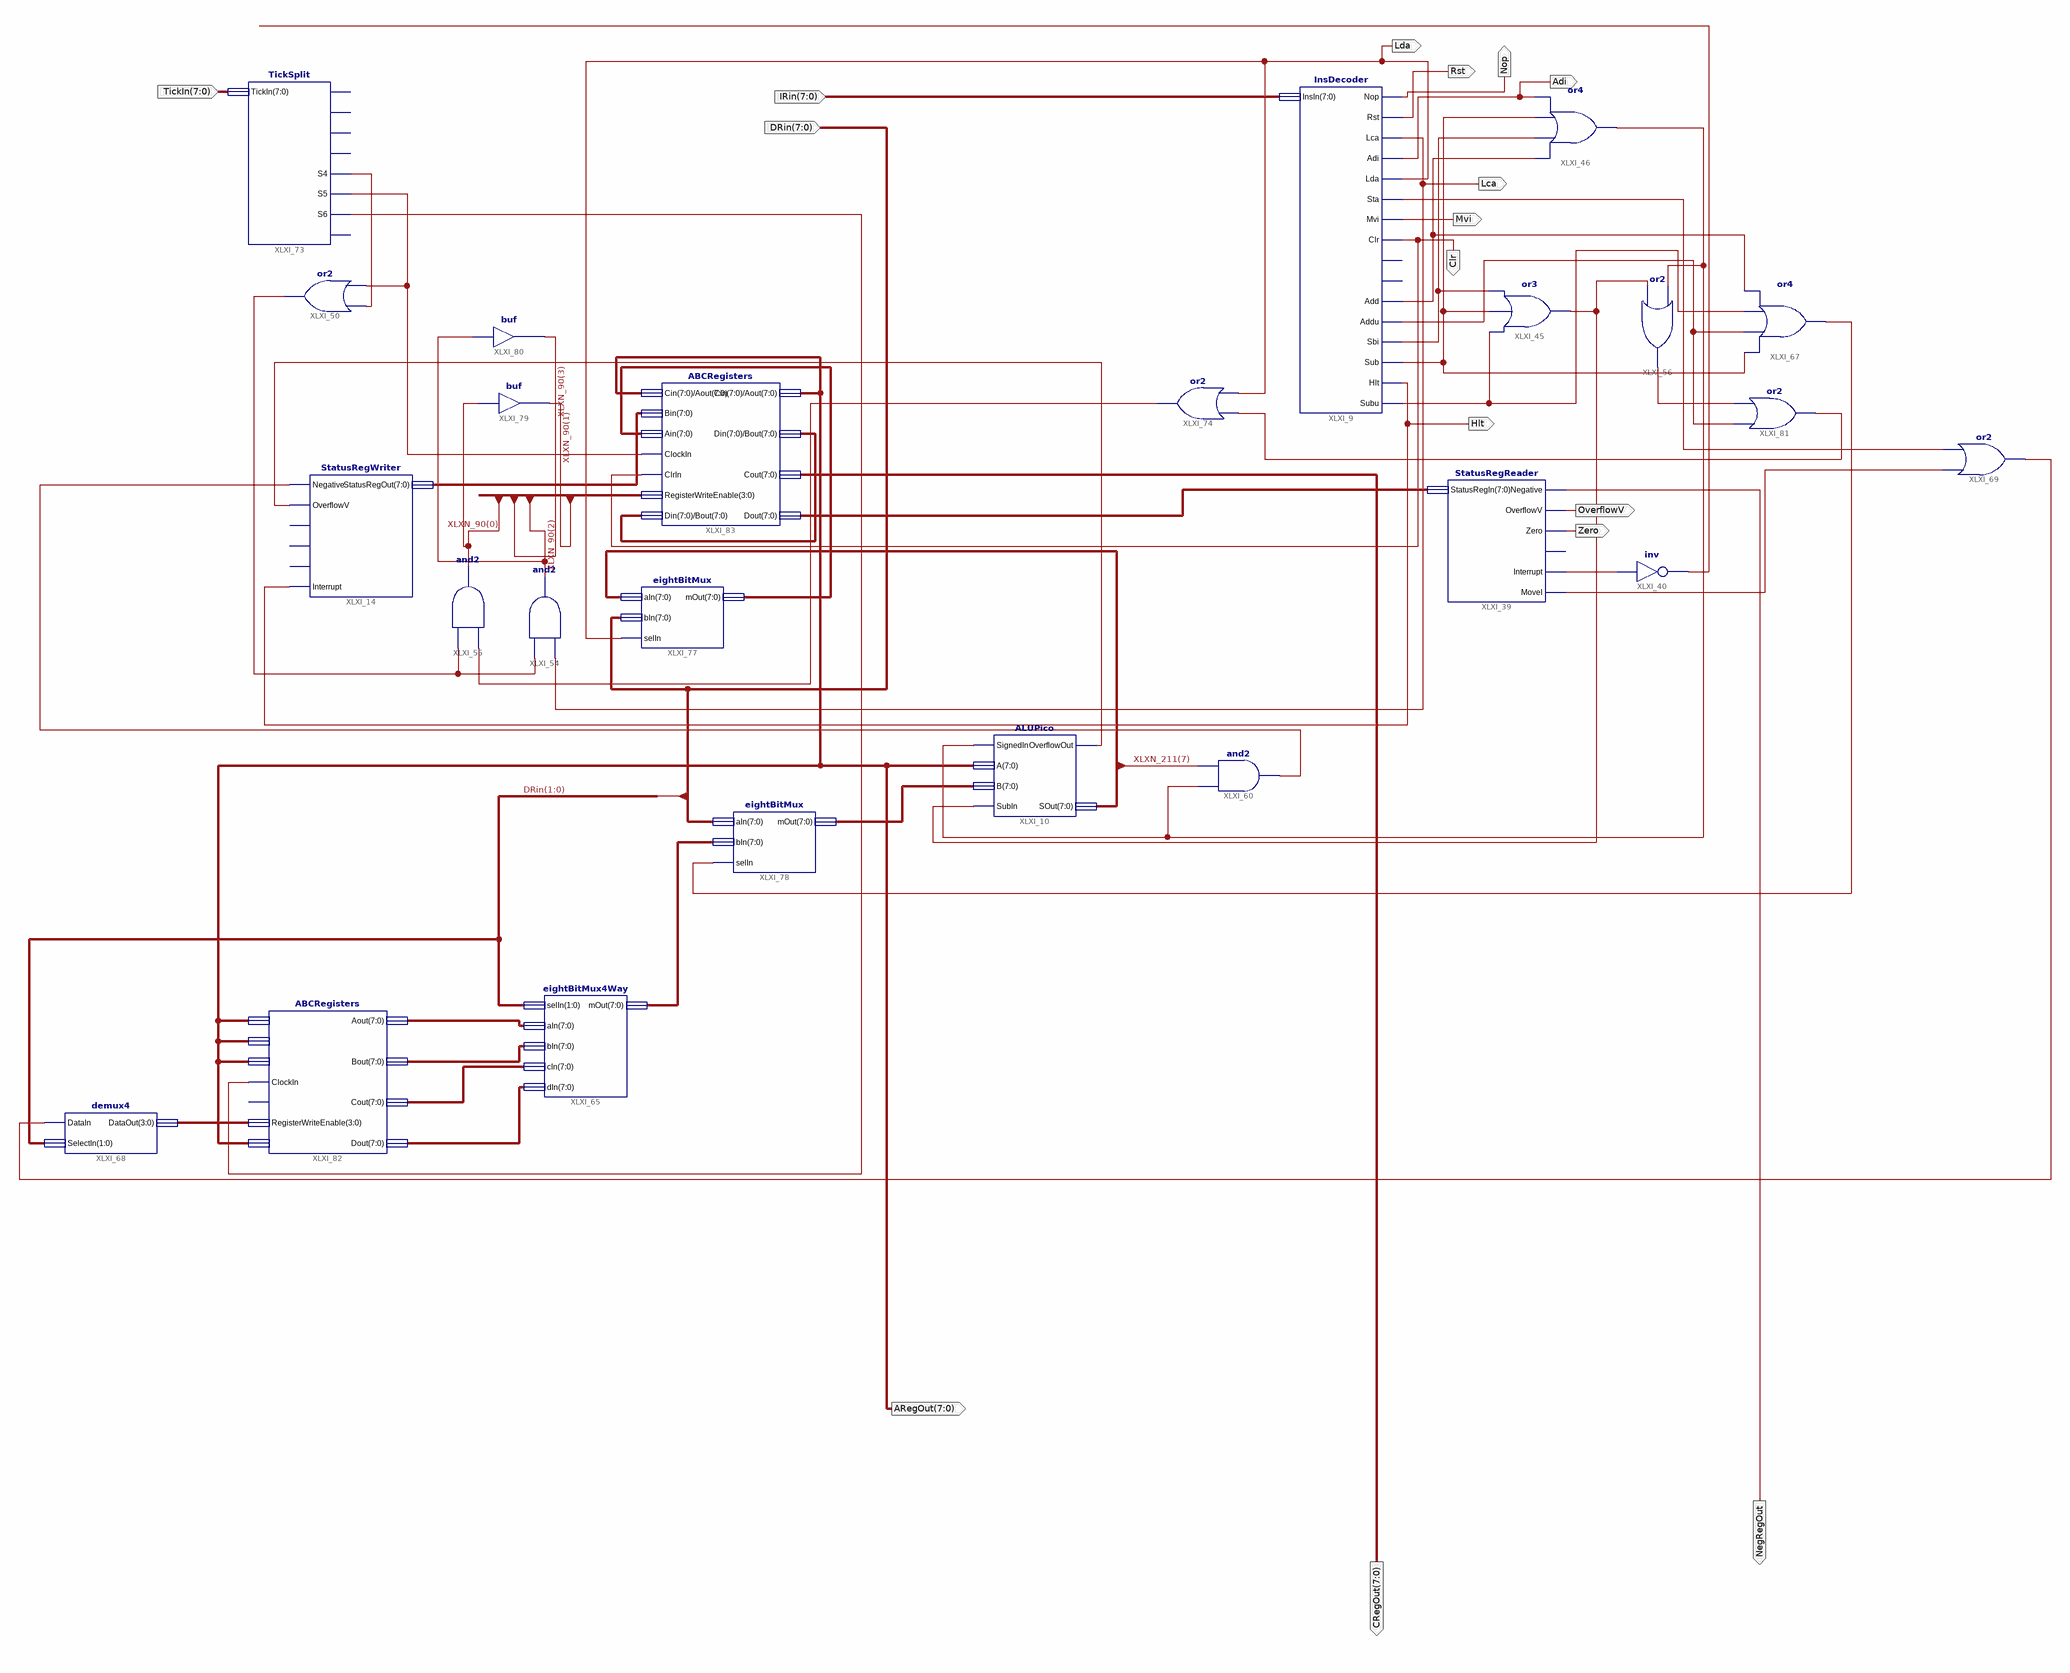
[diagram p0: schematic sheet 1]
// Xilinx ISE schematic picocpu.sch (spartan3e) as structural Verilog: 25 symbols, 16 ports
module picocpu (
  input  [7:0] IRin,
  input  [7:0] DRin,
  input  [7:0] TickIn,
  output [7:0] CRegOut,
  output Hlt,
  output Lca,
  output Clr,
  output NegRegOut,
  output Mvi,
  output Rst,
  output Nop,
  output Adi,
  output [7:0] ARegOut,
  output Lda,
  output OverflowV,
  output Zero
);

  wire XLXN_13, XLXN_16, XLXN_18, XLXN_53, XLXN_55, XLXN_70, XLXN_76, XLXN_77, XLXN_96, XLXN_114, XLXN_115,
       XLXN_137, XLXN_152, XLXN_153, XLXN_157, XLXN_158, XLXN_159, XLXN_191, XLXN_201, XLXN_202, XLXN_213,
       XLXN_227;
  wire [3:0] XLXN_90, XLXN_155;
  wire [7:0] XLXN_46, XLXN_48, XLXN_141, XLXN_142, XLXN_143, XLXN_144, XLXN_150, XLXN_210, XLXN_211,
       XLXN_212, XLXN_223;

  StatusRegReader XLXI_39 (
    .StatusRegIn(XLXN_46), .Negative(NegRegOut), .OverflowV(OverflowV), .Zero(Zero), .Interrupt(XLXN_53),
    .MoveI(XLXN_158));  // open: Transfer
  not XLXI_40 (XLXN_55, XLXN_53);
  InsDecoder XLXI_9 (
    .InsIn(IRin), .Rst(Rst), .Nop(Nop), .Lca(Lca), .Lda(Lda), .Sta(XLXN_157), .Mvi(Mvi), .Clr(Clr),
    .Adi(Adi), .Add(XLXN_152), .Addu(XLXN_70), .Sbi(XLXN_18), .Sub(XLXN_16), .Hlt(Hlt), .Subu(XLXN_76));  // open: Set, Get
  ALUPico XLXI_10 (
    .SignedIn(XLXN_114), .A(ARegOut), .B(XLXN_210), .SubIn(XLXN_13), .OverflowOut(XLXN_77), .SOut(XLXN_211));
  or XLXI_46 (XLXN_114, XLXN_152, XLXN_18, XLXN_16, Adi);
  or XLXI_45 (XLXN_13, XLXN_76, XLXN_16, XLXN_18);
  StatusRegWriter XLXI_14 (
    .Negative(XLXN_115), .OverflowV(XLXN_77), .Interrupt(Hlt), .StatusRegOut(XLXN_48));  // open: Zero, Transfer, MoveI
  and XLXI_54 (XLXN_90[2], Lca, XLXN_96);
  and XLXI_55 (XLXN_90[0], XLXN_202, XLXN_96);
  or XLXI_56 (XLXN_227, XLXN_13, XLXN_114);
  and XLXI_60 (XLXN_115, XLXN_114, XLXN_211[7]);
  eightBitMux4Way XLXI_65 (
    .selIn(DRin[1:0]), .aIn(XLXN_141), .bIn(XLXN_142), .cIn(XLXN_143), .dIn(XLXN_144), .mOut(XLXN_150));
  or XLXI_67 (XLXN_153, XLXN_16, XLXN_70, XLXN_76, XLXN_152);
  demux4 XLXI_68 (.DataIn(XLXN_159), .SelectIn(DRin[1:0]), .DataOut(XLXN_155));
  or XLXI_69 (XLXN_159, XLXN_158, XLXN_157);
  TickSplit XLXI_73 (.TickIn(TickIn), .S4(XLXN_191), .S5(XLXN_137), .S6(XLXN_213));  // open: S0, S1, S2, S3, S7
  or XLXI_50 (XLXN_96, XLXN_137, XLXN_191);
  or XLXI_74 (XLXN_202, Lda, XLXN_201);
  eightBitMux XLXI_77 (.aIn(XLXN_211), .bIn(DRin), .selIn(Lda), .mOut(XLXN_212));
  eightBitMux XLXI_78 (.aIn(DRin), .bIn(XLXN_150), .selIn(XLXN_153), .mOut(XLXN_210));
  buf XLXI_79 (XLXN_90[1], XLXN_90[0]);
  buf XLXI_80 (XLXN_90[3], XLXN_90[2]);
  or XLXI_81 (XLXN_201, XLXN_227, XLXN_70);
  ABCRegisters XLXI_82 (
    .Cin(ARegOut), .Bin(ARegOut), .Ain(ARegOut), .ClockIn(XLXN_213), .RegisterWriteEnable(XLXN_155),
    .Din(ARegOut), .Aout(XLXN_141), .Bout(XLXN_142), .Cout(XLXN_143), .Dout(XLXN_144));  // open: ClrIn
  ABCRegisters XLXI_83 (
    .Cin(ARegOut), .Bin(XLXN_48), .Ain(XLXN_212), .ClockIn(XLXN_137), .ClrIn(Clr),
    .RegisterWriteEnable(XLXN_90), .Din(XLXN_223), .Aout(ARegOut), .Bout(XLXN_223), .Cout(CRegOut),
    .Dout(XLXN_46));
endmodule
